# Altium schematic sheet USB.SchDoc
size A4; SheetNumber: 4; SheetTotal: 5
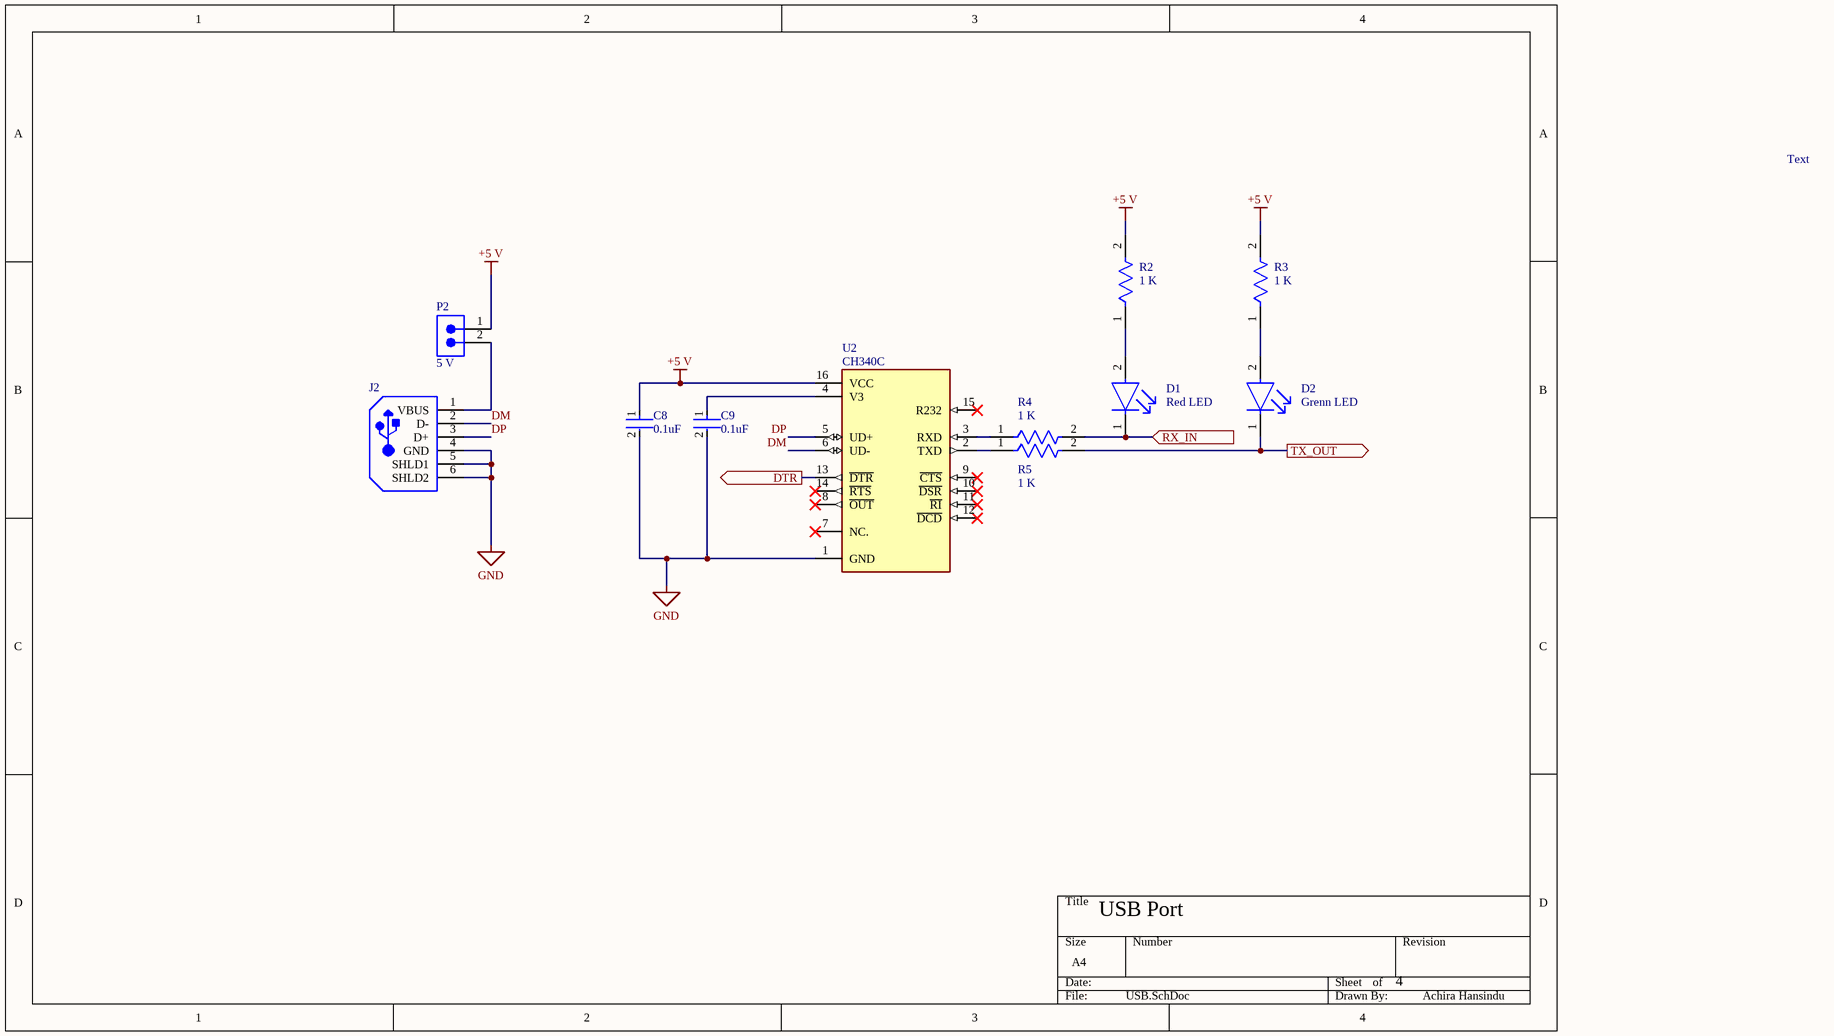
[diagram p0: USB.SchDoc]

## Parts
C8  Capacitance: 0.1uF  [FP-GRM31M-0_15-IPC_A]  (hidden comment: GRM31M1X1H104JA01L)
C9  Capacitance: 0.1uF  [FP-GRM31M-0_15-IPC_A]  (hidden comment: GRM31M1X1H104JA01L)
D1  Color: Red LED  [FP-HSMG-C150-MFG]  (hidden comment: HSMG-C150)
D2  Color: Grenn LED  [FP-HSMG-C150-MFG]  (hidden comment: HSMG-C150)
J2  292303-1  [TE-292303-1_V]  (value not drawn)
P2  5 V  [691322110002]
R2  value 1 K  [FP-CHP1206A-MFG]  (hidden comment: CHP1206AFX-1001ELF)
R3  value 1 K  [FP-CHP1206A-MFG]  (hidden comment: CHP1206AFX-1001ELF)
R4  value 1 K  [FP-CHP1206A-MFG]  (hidden comment: CHP1206AFX-1001ELF)
R5  value 1 K  [FP-CHP1206A-MFG]  (hidden comment: CHP1206AFX-1001ELF)
U2  CH340C  [SOIC127P600X180-16N]

## Ports
DTR (out, see Main[3B], MCU[3B]), RX_IN (in, see Main[3B]), TX_OUT (out, see Main[3B])

## Nets
+5 V: C8.1 P2.1 R2.2 R3.2 U2.16(VCC)
GND: C8.2 C9.2 J2.4(GND) J2.5(SHLD1) J2.6(SHLD2) U2.1(GND)
DM: J2.2(D-) U2.6(UD-)
DP: J2.3(D+) U2.5(UD+)
DTR: U2.13(~{DTR}) ; port DTR
RX_IN: D1.1(C) R4.2 ; port RX_IN
TX_OUT: D2.1(C) R5.2 ; port TX_OUT
NetC9_1: C9.1 U2.4(V3)
NetD1_2: D1.2(A) R2.1
NetD2_2: D2.2(A) R3.1
NetJ2_1: J2.1(VBUS) P2.2
NetR4_1: R4.1 U2.3(RXD)
NetR5_1: R5.1 U2.2(TXD)

Not connected (* = marked no-connect by the designer): U2 7(NC.)* 8(~{OUT})* 9(~{CTS})* 10(~{DSR})* 11(~{RI})* 12(~{DCD})* 14(~{RTS})* 15(R232)*

## Notes on the sheet
- Text
- USB Port
- 4
- Achira Hansindu

## Library data of the parts
C8 C9 = CMP-06035-007547-1: Chip Multilayer Ceramic Capacitors for General Purpose, 1206, 0.10uF, SL, +350/-1000ppm/°C, 5%, 50V; Dissipation Factor: 0.025%; Packaging: Tape and Reel; Length: 0.126inch; Case Code (Imperial): 1206; Voltage Rating (DC): 50V; Max Operating Temperature: 125°C; Voltage: 50V; Height: 1.15mm; Width: 0.063inch; Voltage Rating: 50V; Tolerance: 5%; Min Operating Temperature: -55°C; Mount: Surface Mount; Dielectric Material: Ceramic; Termination: SMD/SMT; Depth: 1.6mm; Case Code (Metric): 3216; Case/Package: 1206; Temperature Coefficient: -1000ppm/°C; Thickness: 0.049inch
D1 D2 = CMP-2000-05061-2: LED GREEN DIFFUSED 1206 SMD; Manufacturer: Broadcom; Led Orientation: Top View; Max Junction Temp: +95°C; Peak Emmision Wavelength: 570nm; Viewing Angle: 170°; Wavelength: 572nm; Reverse Voltage: 5V; Luminous Intensity: 15mcd; Forward Voltage: 2.2V; Power Dissipation: 65mW; Forward Current: 20mA; ComponentLink2Description: Datasheet; Lead Free: Yes; Temperature Range Low: -40°C; Package: HSMG-C150; Digikey Description: LED GREEN DIFFUSED 1206 SMD; Mouser Description: LED Uni-Color Green 570nm 2-Pin Chip LED T/R; Manufacturer Part Number: HSMG-C150; Temperature Range High: +85°C; Device Class L1: Optoelectronics; Colour: Green; Category: Diode; Device Class L3: unset; RoHS: TRUE; Height: 1.2mm; ComponentLink2URL: https://docs.broadcom.com/docs/AV02-0551EN; Device Class L2: LEDs; Automotive: No; Ipc Land Pattern Name: DIOCP320160X55; Octopart: https://octopart.com/hsmg-c150-broadcom-71131304; Temperature: -40°C to +85°C
J2 = CMP-2000-05404-1: 1 Port Right Angle Through Hole Mount Female Type A USB Connector, 4 Position, -55 to 85 degC, RoHS, Tube; Manufacturer: TE Connectivity; Contact Termination Type: Solder; No. of Contacts: 4; Connector Mounting: PCB; SVHC: NoSVHC(16-Jun-2014); Gender: Receptacle; Connector Type: USBA; Package Description: 4-Pin Through Hole Device, Body 14 x 13.13 mm, Pitch 2.5 mm; Contact Plating: Gold; Package Reference: 292303-1; Contact Material: Copper; Datasheet URL: http://www.farnell.com/cad/1653030.pdf; Datasheet Version: Feb-12; Manufacturer URL: http://www.te.com/
P2 = CMP-1502-01791-3: NexarPartId: 18818346; Voltage Rating: 300V; Number of Contacts: 2; Gender: Male; Current: 10A; Number of Levels: 1; Pitch: 3.5052mm; Termination: Solder; Lead Pitch: 3.5mm; Width: 8.1mm; Length: 10.5mm; Number of Positions Per Level: 2; Number of Pins: 2; Max Operating Temperature: 105°C; RoHS: Compliant; Current Rating: 10A; Voltage: 300V; Mount: Through Hole; Color: Green; Min Operating Temperature: -40°C; Height: 7.4mm; Number of Rows: 1; Packaging: Box; Lead Free: Lead Free; REACH SVHC: Unknown; Contact Material: Brass
R2-R5 = CMP-07231-007505-1: RESHIGHPOWERA 1206 1K 1% 3/4W TC
U2 = CH340C: USB to serial chip CH340; MF: WCH; Price: None; Availability: Not in stock; MP: CH340C; Package: None; SnapEDA_Link: https://www.snapeda.com/parts/CH340C/WCH/view-part/?ref=snap; Check_prices: https://www.snapeda.com/parts/CH340C/WCH/view-part/?ref=eda; Value: *